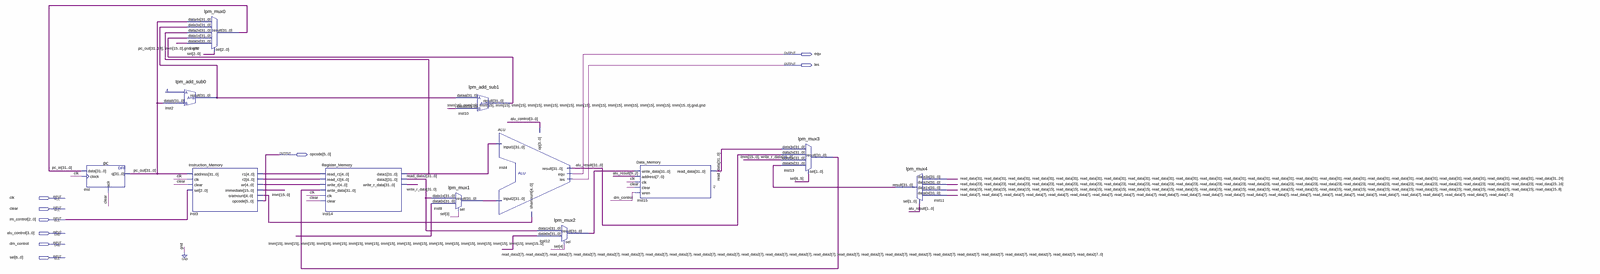
[diagram p0: schematic sheet, whole]
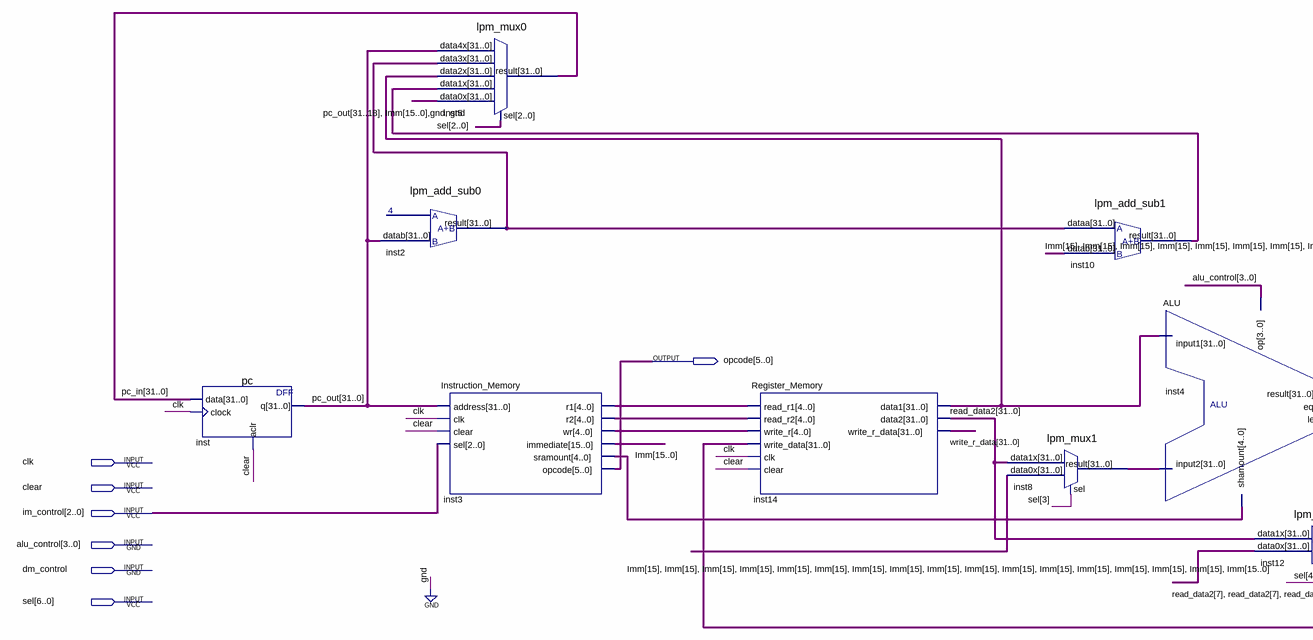
[diagram p1: schematic sheet, left part]
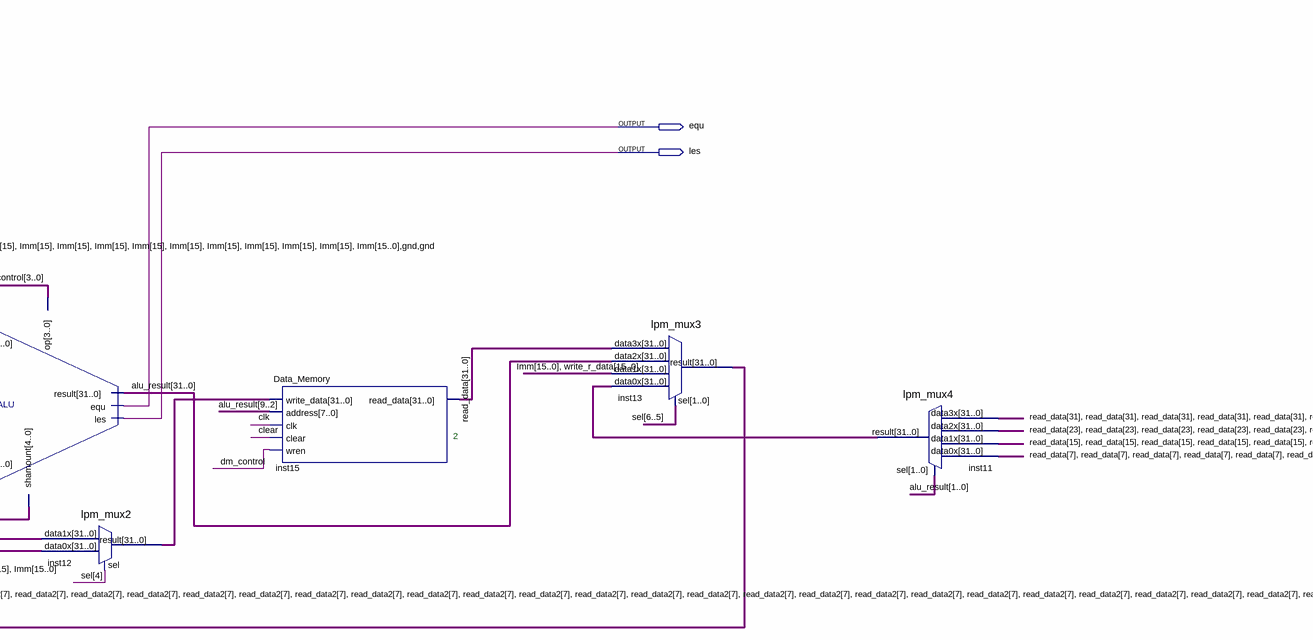
[diagram p2: schematic sheet, centre part]
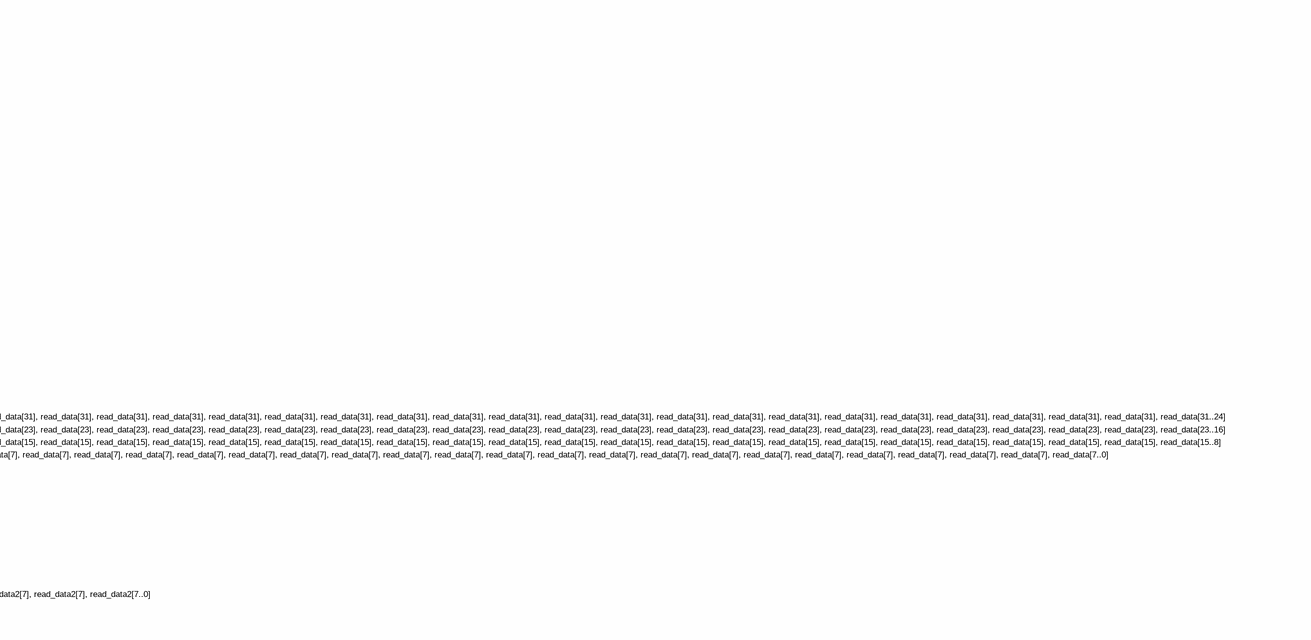
[diagram p3: schematic sheet, right part]
// Quartus schematic DP.bdf as structural Verilog: 12 symbols, 9 pins
module DP (
  input  clk,
  input  clear,
  input  [2:0] im_control,
  input  [3:0] alu_control,
  input  dm_control,
  input  [6:0] sel,
  output equ,
  output les,
  output [5:0] opcode
);

  wire [4:0] inst3_r1, inst3_r2, inst3_sramount, inst3_wr;
  wire [15:0] Imm;
  wire [31:0] alu_result, inst2_result, inst8_result, inst10_result, inst11_result, inst12_result,
       inst13_result, inst14_data1, pc_in, pc_out, read_data, read_data2, write_r_data;

  pc inst (.data(pc_in), .clock(clk), .aclr(clear), .q(pc_out));
  lpm_add_sub0 inst2 (.datab(pc_out), .result(inst2_result));
  lpm_mux0 inst5 (
    .data4x(pc_out), .data3x(inst2_result), .data2x(inst14_data1), .data1x(inst10_result),
    .data0x({pc_out[31:18], Imm, 2'b00}), .sel(sel[2:0]), .result(pc_in));
  Instruction_Memory inst3 (
    .address(pc_out), .clk(clk), .clear(clear), .sel(im_control), .r1(inst3_r1), .r2(inst3_r2),
    .wr(inst3_wr), .immediate(Imm), .sramount(inst3_sramount), .opcode(opcode));
  Register_Memory inst14 (
    .read_r1(inst3_r1), .read_r2(inst3_r2), .write_r(inst3_wr), .write_data(inst13_result), .clk(clk),
    .clear(clear), .data1(inst14_data1), .data2(read_data2), .write_r_data(write_r_data));
  lpm_mux1 inst8 (.data1x(read_data2), .data0x({{17{Imm[15]}}, Imm[14:0]}), .sel(sel[3]), .result(inst8_result));
  lpm_add_sub1 inst10 (.dataa(inst2_result), .datab({{15{Imm[15]}}, Imm[14:0], 2'b00}), .result(inst10_result));
  ALU inst4 (
    .op(alu_control), .input1(inst14_data1), .input2(inst8_result), .shamount(inst3_sramount),
    .result(alu_result), .equ(equ), .les(les));
  lpm_mux2 inst12 (
    .data1x(read_data2), .data0x({{25{read_data2[7]}}, read_data2[6:0]}), .sel(sel[4]), .result(inst12_result));
  Data_Memory inst15 (
    .write_data(inst12_result), .address(alu_result[9:2]), .clk(clk), .clear(clear), .wren(dm_control),
    .read_data(read_data));
  lpm_mux3 inst13 (
    .data3x(read_data), .data2x(alu_result), .data1x({Imm, write_r_data[15:0]}), .data0x(inst11_result),
    .sel(sel[6:5]), .result(inst13_result));
  lpm_mux4 inst11 (
    .data3x({{25{read_data[31]}}, read_data[30:24]}), .data2x({{25{read_data[23]}}, read_data[22:16]}),
    .data1x({{25{read_data[15]}}, read_data[14:8]}), .data0x({{25{read_data[7]}}, read_data[6:0]}),
    .sel(alu_result[1:0]), .result(inst11_result));

  // Notes on the sheet:
  //   2
endmodule
